# Altium schematic sheet 3 way uart switch.SchDoc: UART Switching
size 203 x 127 mm; DrawnBy: Kace Chandler; DocumentNumber: 18; SheetNumber: 18; SheetTotal: 23
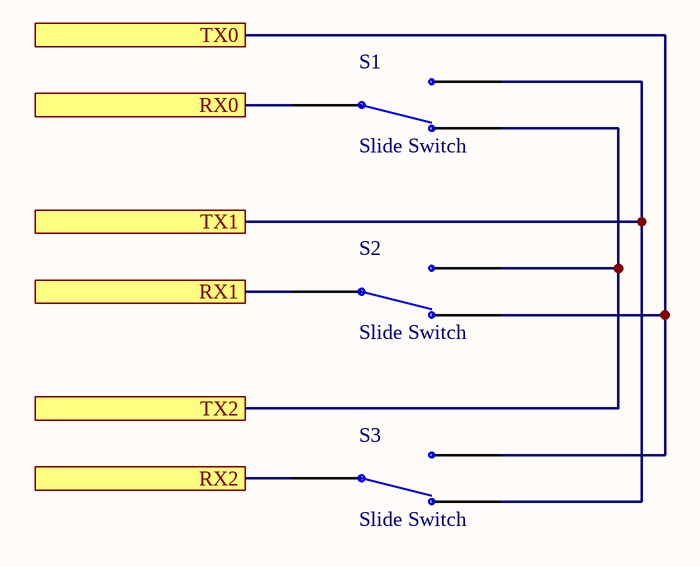
[diagram p0: 3 way uart switch.SchDoc]

## Parts
S1  Slide Switch  [CJS Micro switch]
S2  Slide Switch  [CJS Micro switch]
S3  Slide Switch  [CJS Micro switch]

## Ports
RX0, RX1, RX2, TX0, TX1, TX2

## Nets
RX0: S1.3 ; port RX0
RX1: S2.3 ; port RX1
RX2: S3.3 ; port RX2
TX0: S2.1 S3.2 ; port TX0
TX1: S1.2 S3.1 ; port TX1
TX2: S1.1 S2.2 ; port TX2

## Library data of the parts
S1-S3 = Screw Switch: Supplier 1: Digi-Key; Supplier Part Number 1: 7813J-051ECT-ND